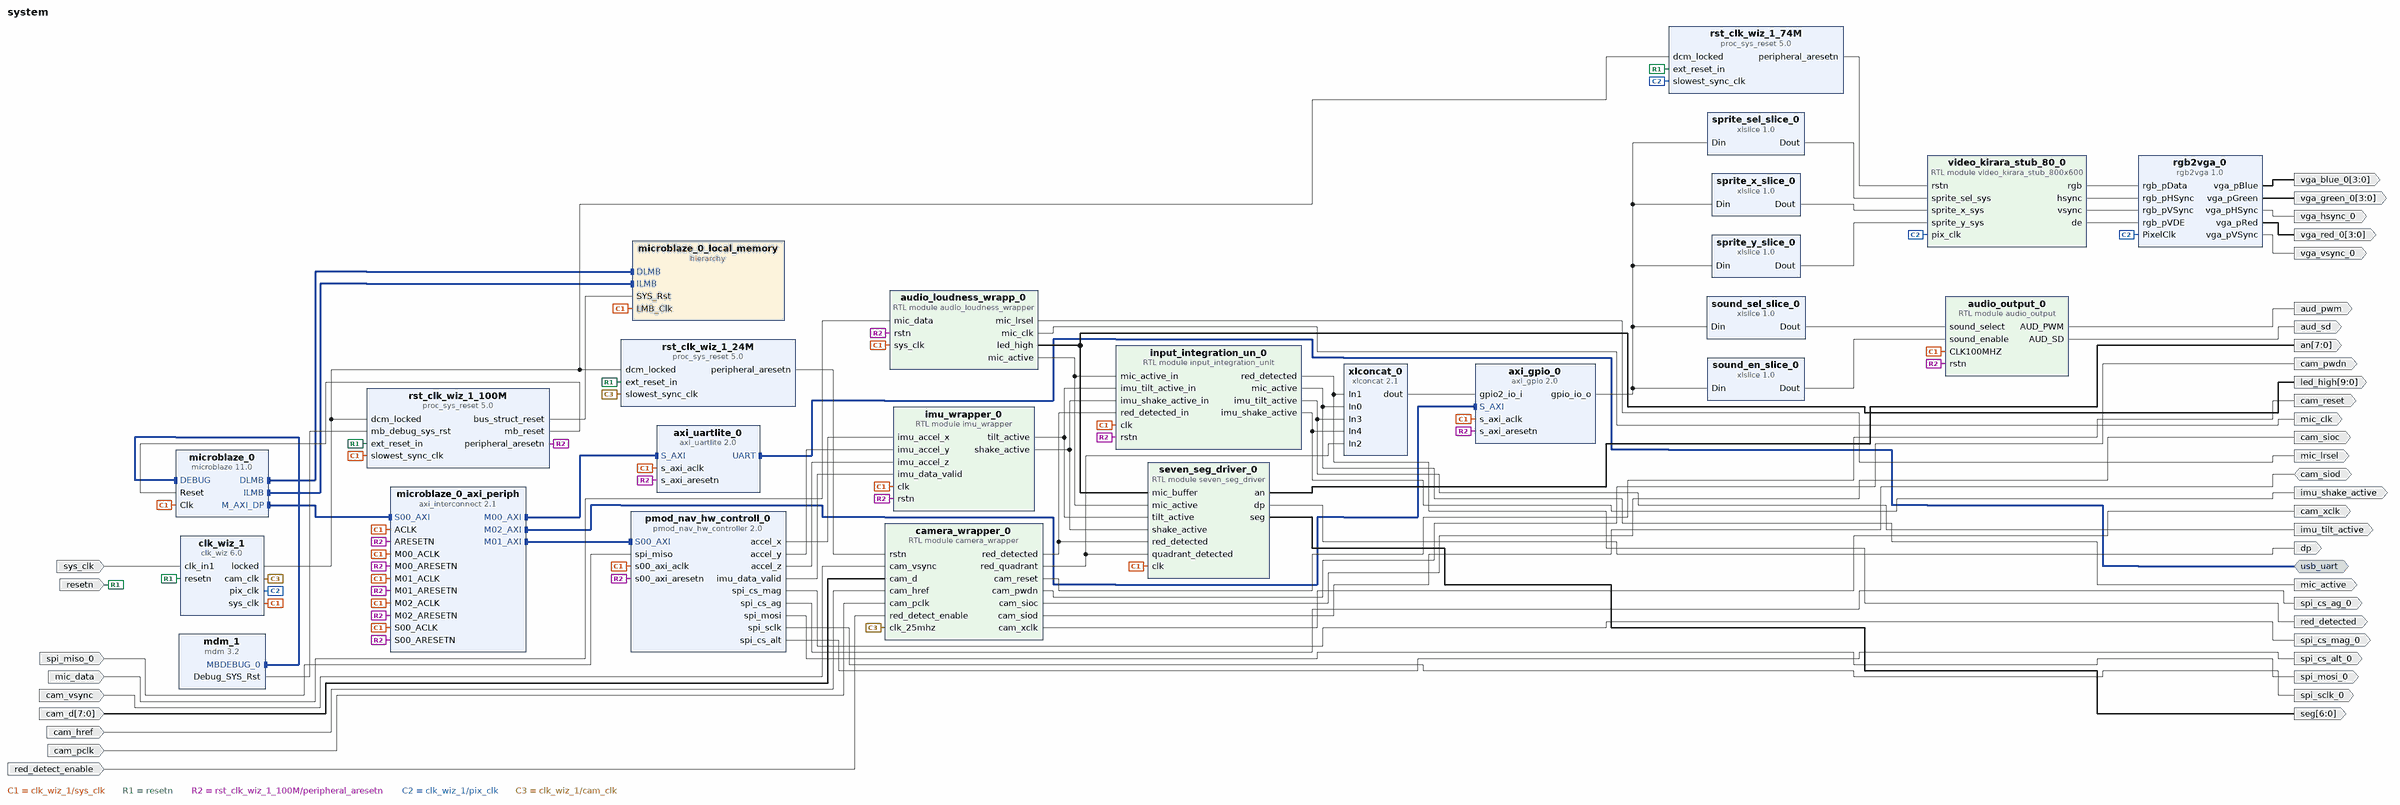
[diagram p0: block diagram of the top level]
# Vivado block design system, xc7a100tcsg324-1, Vivado 2018.3
create_bd_design system

create_bd_intf_port -mode Master -vlnv xilinx.com:interface:uart_rtl:1.0 usb_uart
create_bd_port -dir I -type rst resetn
set_property -dict {CONFIG.POLARITY ACTIVE_LOW} [get_bd_ports resetn]
create_bd_port -dir I -type clk sys_clk
create_bd_port -dir O spi_cs_mag_0
create_bd_port -dir O spi_cs_ag_0
create_bd_port -dir O spi_mosi_0
create_bd_port -dir O spi_sclk_0
create_bd_port -dir O spi_cs_alt_0
create_bd_port -dir I spi_miso_0
create_bd_port -dir O aud_pwm
create_bd_port -dir O aud_sd
create_bd_port -dir I mic_data
create_bd_port -dir O mic_lrsel
create_bd_port -dir O -type clk mic_clk
set_property -dict {CONFIG.FREQ_HZ 3125000} [get_bd_ports mic_clk]
create_bd_port -dir O -from 9 -to 0 led_high
create_bd_port -dir O -from 3 -to 0 vga_red_0
create_bd_port -dir O -from 3 -to 0 vga_green_0
create_bd_port -dir O -from 3 -to 0 vga_blue_0
create_bd_port -dir O vga_hsync_0
create_bd_port -dir O vga_vsync_0
create_bd_port -dir I cam_vsync
create_bd_port -dir I -from 7 -to 0 cam_d
create_bd_port -dir I cam_href
create_bd_port -dir I cam_pclk
create_bd_port -dir O -type rst cam_reset
create_bd_port -dir O cam_pwdn
create_bd_port -dir O cam_sioc
create_bd_port -dir IO cam_siod
create_bd_port -dir O cam_xclk
create_bd_port -dir I red_detect_enable
create_bd_port -dir O red_detected
create_bd_port -dir O mic_active
create_bd_port -dir O imu_tilt_active
create_bd_port -dir O imu_shake_active
create_bd_port -dir O -from 7 -to 0 an
create_bd_port -dir O -from 6 -to 0 seg
create_bd_port -dir O dp

create_bd_cell -type ip -vlnv xilinx.com:ip:microblaze:11.0 microblaze_0
set_property -dict {CONFIG.C_DEBUG_ENABLED 1 CONFIG.C_D_AXI 1 CONFIG.C_D_LMB 1 CONFIG.C_I_LMB 1} [get_bd_cells microblaze_0]
create_bd_cell -type hier microblaze_0_local_memory
create_bd_cell -type ip -vlnv xilinx.com:ip:mdm:3.2 mdm_1
create_bd_cell -type ip -vlnv xilinx.com:ip:clk_wiz:6.0 clk_wiz_1
set_property -dict [list \
  CONFIG.CLKOUT1_JITTER 116.394 \
  CONFIG.CLKOUT1_PHASE_ERROR 87.466 \
  CONFIG.CLKOUT2_JITTER 123.264 \
  CONFIG.CLKOUT2_PHASE_ERROR 87.466 \
  CONFIG.CLKOUT2_REQUESTED_OUT_FREQ 74.25 \
  CONFIG.CLKOUT2_USED true \
  CONFIG.CLKOUT3_JITTER 156.161 \
  CONFIG.CLKOUT3_PHASE_ERROR 87.466 \
  CONFIG.CLKOUT3_REQUESTED_OUT_FREQ 25 \
  CONFIG.CLKOUT3_USED true \
  CONFIG.CLK_OUT1_PORT sys_clk \
  CONFIG.CLK_OUT2_PORT pix_clk \
  CONFIG.CLK_OUT3_PORT cam_clk \
  CONFIG.MMCM_CLKFBOUT_MULT_F 11.875 \
  CONFIG.MMCM_CLKOUT0_DIVIDE_F 11.875 \
  CONFIG.MMCM_CLKOUT1_DIVIDE 16 \
  CONFIG.MMCM_CLKOUT2_DIVIDE 48 \
  CONFIG.MMCM_DIVCLK_DIVIDE 1 \
  CONFIG.NUM_OUT_CLKS 3 \
  CONFIG.PRIM_SOURCE Single_ended_clock_capable_pin \
  CONFIG.RESET_BOARD_INTERFACE reset \
  CONFIG.RESET_PORT resetn \
  CONFIG.RESET_TYPE ACTIVE_LOW \
  CONFIG.USE_BOARD_FLOW true \
] [get_bd_cells clk_wiz_1]
create_bd_cell -type ip -vlnv xilinx.com:ip:proc_sys_reset:5.0 rst_clk_wiz_1_100M
set_property -dict {CONFIG.RESET_BOARD_INTERFACE reset CONFIG.USE_BOARD_FLOW true} [get_bd_cells rst_clk_wiz_1_100M]
create_bd_cell -type ip -vlnv xilinx.com:ip:axi_uartlite:2.0 axi_uartlite_0
set_property -dict {CONFIG.UARTLITE_BOARD_INTERFACE usb_uart CONFIG.USE_BOARD_FLOW true} [get_bd_cells axi_uartlite_0]
create_bd_cell -type ip -vlnv xilinx.com:ip:axi_interconnect:2.1 microblaze_0_axi_periph
set_property -dict {CONFIG.NUM_MI 3} [get_bd_cells microblaze_0_axi_periph]
create_bd_cell -type ip -vlnv digilentinc.com:ip:rgb2vga:1.0 rgb2vga_0
set_property -dict [list \
  CONFIG.VID_IN_DATA_WIDTH 12 \
  CONFIG.kBlueDepth 4 \
  CONFIG.kGreenDepth 4 \
  CONFIG.kRedDepth 4 \
] [get_bd_cells rgb2vga_0]
create_bd_cell -type ip -vlnv xilinx.com:ip:proc_sys_reset:5.0 rst_clk_wiz_1_74M
set_property -dict {CONFIG.RESET_BOARD_INTERFACE reset CONFIG.USE_BOARD_FLOW true} [get_bd_cells rst_clk_wiz_1_74M]
create_bd_cell -type ip -vlnv xilinx.com:ip:axi_gpio:2.0 axi_gpio_0
set_property -dict [list \
  CONFIG.C_ALL_INPUTS_2 1 \
  CONFIG.C_ALL_OUTPUTS 1 \
  CONFIG.C_GPIO2_WIDTH 8 \
  CONFIG.C_GPIO_WIDTH 27 \
  CONFIG.C_IS_DUAL 1 \
  CONFIG.GPIO_BOARD_INTERFACE Custom \
  CONFIG.USE_BOARD_FLOW true \
] [get_bd_cells axi_gpio_0]
create_bd_cell -type ip -vlnv xilinx.com:ip:proc_sys_reset:5.0 rst_clk_wiz_1_24M
create_bd_cell -type ip -vlnv xilinx.com:ip:xlconcat:2.1 xlconcat_0
set_property -dict [list \
  CONFIG.IN0_WIDTH 1 \
  CONFIG.IN1_WIDTH 1 \
  CONFIG.IN2_WIDTH 4 \
  CONFIG.IN3_WIDTH 1 \
  CONFIG.IN4_WIDTH 1 \
  CONFIG.NUM_PORTS 5 \
] [get_bd_cells xlconcat_0]
create_bd_cell -type ip -vlnv xilinx.com:ip:xlslice:1.0 sprite_sel_slice_0
set_property -dict {CONFIG.DIN_FROM 2 CONFIG.DIN_TO 0 CONFIG.DIN_WIDTH 27 CONFIG.DOUT_WIDTH 3} [get_bd_cells sprite_sel_slice_0]
create_bd_cell -type ip -vlnv xilinx.com:ip:xlslice:1.0 sprite_x_slice_0
set_property -dict {CONFIG.DIN_FROM 12 CONFIG.DIN_TO 3 CONFIG.DIN_WIDTH 27 CONFIG.DOUT_WIDTH 10} [get_bd_cells sprite_x_slice_0]
create_bd_cell -type ip -vlnv xilinx.com:ip:xlslice:1.0 sprite_y_slice_0
set_property -dict {CONFIG.DIN_FROM 22 CONFIG.DIN_TO 13 CONFIG.DIN_WIDTH 27 CONFIG.DOUT_WIDTH 10} [get_bd_cells sprite_y_slice_0]
create_bd_cell -type ip -vlnv xilinx.com:ip:xlslice:1.0 sound_sel_slice_0
set_property -dict {CONFIG.DIN_FROM 25 CONFIG.DIN_TO 23 CONFIG.DIN_WIDTH 27 CONFIG.DOUT_WIDTH 3} [get_bd_cells sound_sel_slice_0]
create_bd_cell -type ip -vlnv xilinx.com:ip:xlslice:1.0 sound_en_slice_0
set_property -dict {CONFIG.DIN_FROM 26 CONFIG.DIN_TO 26 CONFIG.DIN_WIDTH 27 CONFIG.DOUT_WIDTH 1} [get_bd_cells sound_en_slice_0]
create_bd_cell -type module -reference video_kirara_stub_800x600 video_kirara_stub_80_0
create_bd_cell -type module -reference audio_output audio_output_0
create_bd_cell -type module -reference audio_loudness_wrapper audio_loudness_wrapp_0
create_bd_cell -type module -reference input_integration_unit input_integration_un_0
create_bd_cell -type module -reference camera_wrapper camera_wrapper_0
create_bd_cell -type module -reference imu_wrapper imu_wrapper_0
create_bd_cell -type module -reference seven_seg_driver seven_seg_driver_0
create_bd_cell -type ip -vlnv user.org:user:pmod_nav_hw_controller:2.0 pmod_nav_hw_controll_0

# ---- hierarchy /microblaze_0_local_memory ----
current_bd_instance /microblaze_0_local_memory
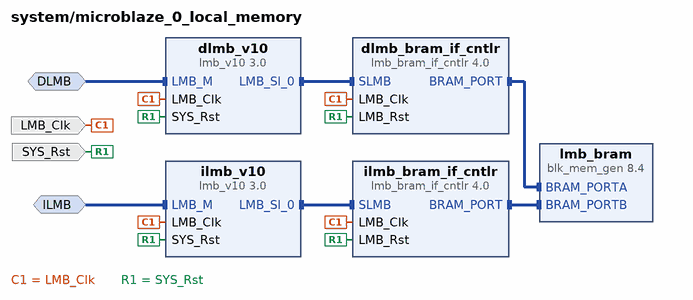
[diagram p1: block diagram inside /microblaze_0_local_memory]
create_bd_intf_pin -mode MirroredMaster -vlnv xilinx.com:interface:lmb_rtl:1.0 DLMB
create_bd_intf_pin -mode MirroredMaster -vlnv xilinx.com:interface:lmb_rtl:1.0 ILMB
create_bd_pin -dir I -type clk LMB_Clk
create_bd_pin -dir I -type rst SYS_Rst

create_bd_cell -type ip -vlnv xilinx.com:ip:lmb_v10:3.0 dlmb_v10
create_bd_cell -type ip -vlnv xilinx.com:ip:lmb_v10:3.0 ilmb_v10
create_bd_cell -type ip -vlnv xilinx.com:ip:lmb_bram_if_cntlr:4.0 dlmb_bram_if_cntlr
set_property -dict {CONFIG.C_ECC 0} [get_bd_cells dlmb_bram_if_cntlr]
create_bd_cell -type ip -vlnv xilinx.com:ip:lmb_bram_if_cntlr:4.0 ilmb_bram_if_cntlr
set_property -dict {CONFIG.C_ECC 0} [get_bd_cells ilmb_bram_if_cntlr]
create_bd_cell -type ip -vlnv xilinx.com:ip:blk_mem_gen:8.4 lmb_bram
set_property -dict {CONFIG.Memory_Type True_Dual_Port_RAM CONFIG.use_bram_block BRAM_Controller} [get_bd_cells lmb_bram]

# ---- connections ----

current_bd_instance /microblaze_0_local_memory
connect_bd_intf_net -intf_net microblaze_0_ilmb_cntlr [get_bd_intf_pins ilmb_bram_if_cntlr/BRAM_PORT] [get_bd_intf_pins lmb_bram/BRAM_PORTB]
connect_bd_intf_net -intf_net microblaze_0_dlmb_bus [get_bd_intf_pins dlmb_v10/LMB_Sl_0] [get_bd_intf_pins dlmb_bram_if_cntlr/SLMB]
connect_bd_intf_net -intf_net microblaze_0_ilmb [get_bd_intf_pins ILMB] [get_bd_intf_pins ilmb_v10/LMB_M]
connect_bd_intf_net -intf_net microblaze_0_dlmb [get_bd_intf_pins DLMB] [get_bd_intf_pins dlmb_v10/LMB_M]
connect_bd_intf_net -intf_net microblaze_0_dlmb_cntlr [get_bd_intf_pins dlmb_bram_if_cntlr/BRAM_PORT] [get_bd_intf_pins lmb_bram/BRAM_PORTA]
connect_bd_intf_net -intf_net microblaze_0_ilmb_bus [get_bd_intf_pins ilmb_v10/LMB_Sl_0] [get_bd_intf_pins ilmb_bram_if_cntlr/SLMB]
connect_bd_net -net microblaze_0_Clk [get_bd_pins LMB_Clk] \
  [get_bd_pins dlmb_v10/LMB_Clk] [get_bd_pins dlmb_bram_if_cntlr/LMB_Clk] [get_bd_pins ilmb_v10/LMB_Clk] \
  [get_bd_pins ilmb_bram_if_cntlr/LMB_Clk]
connect_bd_net [get_bd_pins SYS_Rst] \
  [get_bd_pins dlmb_v10/SYS_Rst] [get_bd_pins dlmb_bram_if_cntlr/LMB_Rst] [get_bd_pins ilmb_v10/SYS_Rst] \
  [get_bd_pins ilmb_bram_if_cntlr/LMB_Rst]
set_property HDL_ATTRIBUTE.BMM_INFO_ADDRESS_SPACE {byte  0x00000000 32 > system microblaze_0_local_memory/lmb_bram} [get_bd_cells dlmb_bram_if_cntlr]
set_property HDL_ATTRIBUTE.KEEP_HIERARCHY yes [get_bd_cells dlmb_bram_if_cntlr]

current_bd_instance /
connect_bd_intf_net [get_bd_intf_pins microblaze_0_axi_periph/M00_AXI] [get_bd_intf_pins axi_uartlite_0/S_AXI]
connect_bd_intf_net [get_bd_intf_pins mdm_1/MBDEBUG_0] [get_bd_intf_pins microblaze_0/DEBUG]
connect_bd_intf_net [get_bd_intf_pins microblaze_0/DLMB] [get_bd_intf_pins microblaze_0_local_memory/DLMB]
connect_bd_intf_net [get_bd_intf_pins microblaze_0_axi_periph/M02_AXI] [get_bd_intf_pins axi_gpio_0/S_AXI]
connect_bd_intf_net [get_bd_intf_pins microblaze_0/M_AXI_DP] [get_bd_intf_pins microblaze_0_axi_periph/S00_AXI]
connect_bd_intf_net [get_bd_intf_ports usb_uart] [get_bd_intf_pins axi_uartlite_0/UART]
connect_bd_intf_net [get_bd_intf_pins microblaze_0/ILMB] [get_bd_intf_pins microblaze_0_local_memory/ILMB]
connect_bd_intf_net [get_bd_intf_pins microblaze_0_axi_periph/M01_AXI] [get_bd_intf_pins pmod_nav_hw_controll_0/S00_AXI]
connect_bd_net -net microblaze_0_Clk [get_bd_pins clk_wiz_1/sys_clk] \
  [get_bd_pins microblaze_0/Clk] [get_bd_pins microblaze_0_local_memory/LMB_Clk] \
  [get_bd_pins rst_clk_wiz_1_100M/slowest_sync_clk] [get_bd_pins microblaze_0_axi_periph/S00_ACLK] \
  [get_bd_pins axi_uartlite_0/s_axi_aclk] [get_bd_pins microblaze_0_axi_periph/M00_ACLK] \
  [get_bd_pins microblaze_0_axi_periph/ACLK] [get_bd_pins microblaze_0_axi_periph/M01_ACLK] \
  [get_bd_pins axi_gpio_0/s_axi_aclk] [get_bd_pins microblaze_0_axi_periph/M02_ACLK] [get_bd_pins audio_output_0/CLK100MHZ] \
  [get_bd_pins audio_loudness_wrapp_0/sys_clk] [get_bd_pins input_integration_un_0/clk] [get_bd_pins imu_wrapper_0/clk] \
  [get_bd_pins seven_seg_driver_0/clk] [get_bd_pins pmod_nav_hw_controll_0/s00_axi_aclk]
connect_bd_net [get_bd_pins clk_wiz_1/locked] \
  [get_bd_pins rst_clk_wiz_1_100M/dcm_locked] [get_bd_pins rst_clk_wiz_1_74M/dcm_locked] \
  [get_bd_pins rst_clk_wiz_1_24M/dcm_locked]
connect_bd_net [get_bd_pins rst_clk_wiz_1_100M/mb_reset] [get_bd_pins microblaze_0/Reset]
connect_bd_net [get_bd_pins rst_clk_wiz_1_100M/bus_struct_reset] [get_bd_pins microblaze_0_local_memory/SYS_Rst]
connect_bd_net [get_bd_pins mdm_1/Debug_SYS_Rst] [get_bd_pins rst_clk_wiz_1_100M/mb_debug_sys_rst]
connect_bd_net -net reset_1 [get_bd_ports resetn] \
  [get_bd_pins clk_wiz_1/resetn] [get_bd_pins rst_clk_wiz_1_100M/ext_reset_in] [get_bd_pins rst_clk_wiz_1_74M/ext_reset_in] \
  [get_bd_pins rst_clk_wiz_1_24M/ext_reset_in]
connect_bd_net [get_bd_pins rst_clk_wiz_1_100M/peripheral_aresetn] \
  [get_bd_pins microblaze_0_axi_periph/S00_ARESETN] [get_bd_pins axi_uartlite_0/s_axi_aresetn] \
  [get_bd_pins microblaze_0_axi_periph/M00_ARESETN] [get_bd_pins microblaze_0_axi_periph/ARESETN] \
  [get_bd_pins microblaze_0_axi_periph/M01_ARESETN] [get_bd_pins axi_gpio_0/s_axi_aresetn] \
  [get_bd_pins microblaze_0_axi_periph/M02_ARESETN] [get_bd_pins audio_output_0/rstn] \
  [get_bd_pins audio_loudness_wrapp_0/rstn] [get_bd_pins input_integration_un_0/rstn] [get_bd_pins imu_wrapper_0/rstn] \
  [get_bd_pins pmod_nav_hw_controll_0/s00_axi_aresetn]
connect_bd_net -net clk_in1_0_1 [get_bd_ports sys_clk] [get_bd_pins clk_wiz_1/clk_in1]
connect_bd_net [get_bd_pins pmod_nav_hw_controll_0/spi_cs_mag] [get_bd_ports spi_cs_mag_0]
connect_bd_net [get_bd_pins pmod_nav_hw_controll_0/spi_cs_ag] [get_bd_ports spi_cs_ag_0]
connect_bd_net [get_bd_pins pmod_nav_hw_controll_0/spi_mosi] [get_bd_ports spi_mosi_0]
connect_bd_net [get_bd_pins pmod_nav_hw_controll_0/spi_sclk] [get_bd_ports spi_sclk_0]
connect_bd_net [get_bd_pins pmod_nav_hw_controll_0/spi_cs_alt] [get_bd_ports spi_cs_alt_0]
connect_bd_net -net spi_miso_0_1 [get_bd_ports spi_miso_0] [get_bd_pins pmod_nav_hw_controll_0/spi_miso]
connect_bd_net [get_bd_pins clk_wiz_1/pix_clk] \
  [get_bd_pins rst_clk_wiz_1_74M/slowest_sync_clk] [get_bd_pins rgb2vga_0/PixelClk] \
  [get_bd_pins video_kirara_stub_80_0/pix_clk]
connect_bd_net [get_bd_pins rst_clk_wiz_1_74M/peripheral_aresetn] [get_bd_pins video_kirara_stub_80_0/rstn]
connect_bd_net [get_bd_pins video_kirara_stub_80_0/rgb] [get_bd_pins rgb2vga_0/rgb_pData]
connect_bd_net [get_bd_pins video_kirara_stub_80_0/hsync] [get_bd_pins rgb2vga_0/rgb_pHSync]
connect_bd_net [get_bd_pins video_kirara_stub_80_0/vsync] [get_bd_pins rgb2vga_0/rgb_pVSync]
connect_bd_net [get_bd_pins video_kirara_stub_80_0/de] [get_bd_pins rgb2vga_0/rgb_pVDE]
connect_bd_net [get_bd_pins audio_output_0/AUD_PWM] [get_bd_ports aud_pwm]
connect_bd_net [get_bd_pins audio_output_0/AUD_SD] [get_bd_ports aud_sd]
connect_bd_net -net mic_data_0_1 [get_bd_ports mic_data] [get_bd_pins audio_loudness_wrapp_0/mic_data]
connect_bd_net [get_bd_pins audio_loudness_wrapp_0/mic_lrsel] [get_bd_ports mic_lrsel]
connect_bd_net [get_bd_pins audio_loudness_wrapp_0/mic_clk] [get_bd_ports mic_clk]
connect_bd_net [get_bd_pins audio_loudness_wrapp_0/mic_active] \
  [get_bd_pins input_integration_un_0/mic_active_in] [get_bd_pins seven_seg_driver_0/mic_active]
connect_bd_net [get_bd_pins audio_loudness_wrapp_0/led_high] [get_bd_ports led_high] [get_bd_pins seven_seg_driver_0/mic_buffer]
connect_bd_net [get_bd_pins rgb2vga_0/vga_pRed] [get_bd_ports vga_red_0]
connect_bd_net [get_bd_pins rgb2vga_0/vga_pGreen] [get_bd_ports vga_green_0]
connect_bd_net [get_bd_pins rgb2vga_0/vga_pBlue] [get_bd_ports vga_blue_0]
connect_bd_net [get_bd_pins rgb2vga_0/vga_pHSync] [get_bd_ports vga_hsync_0]
connect_bd_net [get_bd_pins rgb2vga_0/vga_pVSync] [get_bd_ports vga_vsync_0]
connect_bd_net -net cam_vsync_0_1 [get_bd_ports cam_vsync] [get_bd_pins camera_wrapper_0/cam_vsync]
connect_bd_net -net cam_d_0_1 [get_bd_ports cam_d] [get_bd_pins camera_wrapper_0/cam_d]
connect_bd_net -net cam_href_0_1 [get_bd_ports cam_href] [get_bd_pins camera_wrapper_0/cam_href]
connect_bd_net -net cam_pclk_0_1 [get_bd_ports cam_pclk] [get_bd_pins camera_wrapper_0/cam_pclk]
connect_bd_net [get_bd_pins camera_wrapper_0/cam_reset] [get_bd_ports cam_reset]
connect_bd_net [get_bd_pins camera_wrapper_0/cam_pwdn] [get_bd_ports cam_pwdn]
connect_bd_net [get_bd_pins camera_wrapper_0/cam_sioc] [get_bd_ports cam_sioc]
connect_bd_net [get_bd_ports cam_siod] [get_bd_pins camera_wrapper_0/cam_siod]
connect_bd_net [get_bd_pins camera_wrapper_0/cam_xclk] [get_bd_ports cam_xclk]
connect_bd_net [get_bd_pins camera_wrapper_0/red_quadrant] [get_bd_pins xlconcat_0/In2] [get_bd_pins seven_seg_driver_0/quadrant_detected]
connect_bd_net -net red_detect_enable_0_1 [get_bd_ports red_detect_enable] [get_bd_pins camera_wrapper_0/red_detect_enable]
connect_bd_net [get_bd_pins pmod_nav_hw_controll_0/accel_x] [get_bd_pins imu_wrapper_0/imu_accel_x]
connect_bd_net [get_bd_pins pmod_nav_hw_controll_0/accel_y] [get_bd_pins imu_wrapper_0/imu_accel_y]
connect_bd_net [get_bd_pins pmod_nav_hw_controll_0/accel_z] [get_bd_pins imu_wrapper_0/imu_accel_z]
connect_bd_net [get_bd_pins pmod_nav_hw_controll_0/imu_data_valid] [get_bd_pins imu_wrapper_0/imu_data_valid]
connect_bd_net [get_bd_pins imu_wrapper_0/tilt_active] \
  [get_bd_pins input_integration_un_0/imu_tilt_active_in] [get_bd_pins seven_seg_driver_0/tilt_active]
connect_bd_net [get_bd_pins imu_wrapper_0/shake_active] \
  [get_bd_pins input_integration_un_0/imu_shake_active_in] [get_bd_pins seven_seg_driver_0/shake_active]
connect_bd_net [get_bd_pins camera_wrapper_0/red_detected] \
  [get_bd_pins input_integration_un_0/red_detected_in] [get_bd_pins seven_seg_driver_0/red_detected]
connect_bd_net [get_bd_pins input_integration_un_0/red_detected] [get_bd_ports red_detected] [get_bd_pins xlconcat_0/In1]
connect_bd_net [get_bd_pins input_integration_un_0/mic_active] [get_bd_ports mic_active] [get_bd_pins xlconcat_0/In0]
connect_bd_net [get_bd_pins input_integration_un_0/imu_tilt_active] [get_bd_ports imu_tilt_active] [get_bd_pins xlconcat_0/In3]
connect_bd_net [get_bd_pins input_integration_un_0/imu_shake_active] [get_bd_ports imu_shake_active] [get_bd_pins xlconcat_0/In4]
connect_bd_net [get_bd_pins clk_wiz_1/cam_clk] [get_bd_pins rst_clk_wiz_1_24M/slowest_sync_clk] [get_bd_pins camera_wrapper_0/clk_25mhz]
connect_bd_net [get_bd_pins rst_clk_wiz_1_24M/peripheral_aresetn] [get_bd_pins camera_wrapper_0/rstn]
connect_bd_net [get_bd_pins xlconcat_0/dout] [get_bd_pins axi_gpio_0/gpio2_io_i]
connect_bd_net [get_bd_pins axi_gpio_0/gpio_io_o] \
  [get_bd_pins sprite_sel_slice_0/Din] [get_bd_pins sprite_x_slice_0/Din] [get_bd_pins sprite_y_slice_0/Din] \
  [get_bd_pins sound_sel_slice_0/Din] [get_bd_pins sound_en_slice_0/Din]
connect_bd_net [get_bd_pins sprite_sel_slice_0/Dout] [get_bd_pins video_kirara_stub_80_0/sprite_sel_sys]
connect_bd_net [get_bd_pins sprite_x_slice_0/Dout] [get_bd_pins video_kirara_stub_80_0/sprite_x_sys]
connect_bd_net [get_bd_pins sprite_y_slice_0/Dout] [get_bd_pins video_kirara_stub_80_0/sprite_y_sys]
connect_bd_net [get_bd_pins sound_sel_slice_0/Dout] [get_bd_pins audio_output_0/sound_select]
connect_bd_net [get_bd_pins sound_en_slice_0/Dout] [get_bd_pins audio_output_0/sound_enable]
connect_bd_net [get_bd_pins seven_seg_driver_0/an] [get_bd_ports an]
connect_bd_net [get_bd_pins seven_seg_driver_0/seg] [get_bd_ports seg]
connect_bd_net [get_bd_pins seven_seg_driver_0/dp] [get_bd_ports dp]
set_property HDL_ATTRIBUTE.BMM_INFO_PROCESSOR {microblaze-le > system microblaze_0_local_memory/dlmb_bram_if_cntlr} [get_bd_cells microblaze_0]
set_property HDL_ATTRIBUTE.KEEP_HIERARCHY yes [get_bd_cells microblaze_0]

# ---- address map ----
assign_bd_address -offset 0x00000000 -range 8K -target_address_space [get_bd_addr_spaces microblaze_0/Data] [get_bd_addr_segs microblaze_0_local_memory/dlmb_bram_if_cntlr/SLMB/Mem]
assign_bd_address -offset 0x40000000 -range 64K -target_address_space [get_bd_addr_spaces microblaze_0/Data] [get_bd_addr_segs axi_gpio_0/S_AXI/Reg]
assign_bd_address -offset 0x40600000 -range 64K -target_address_space [get_bd_addr_spaces microblaze_0/Data] [get_bd_addr_segs axi_uartlite_0/S_AXI/Reg]
assign_bd_address -offset 0x44A00000 -range 64K -target_address_space [get_bd_addr_spaces microblaze_0/Data] [get_bd_addr_segs pmod_nav_hw_controll_0/S00_AXI/S00_AXI_reg]
assign_bd_address -offset 0x00000000 -range 8K -target_address_space [get_bd_addr_spaces microblaze_0/Instruction] [get_bd_addr_segs microblaze_0_local_memory/ilmb_bram_if_cntlr/SLMB/Mem]

validate_bd_design
save_bd_design
